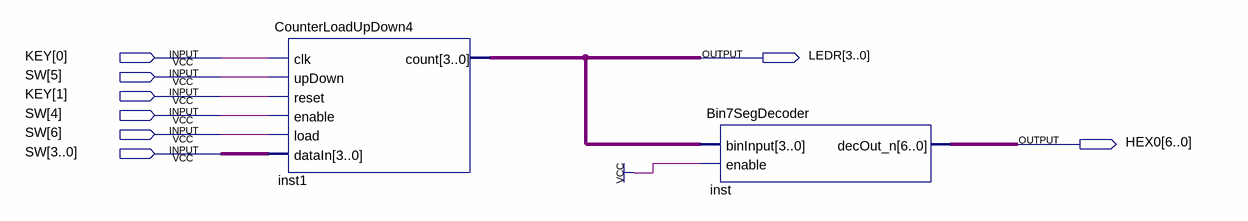
[diagram p0: schematic sheet]
// Quartus schematic Counter_Demo.bdf as structural Verilog: 2 symbols, 8 pins
module Counter_Demo (
  input  [1:0] KEY,
  input  [6:0] SW,
  output [3:0] LEDR,
  output [6:0] HEX0
);

  CounterLoadUpDown4 inst1 (
    .clk(KEY[0]), .upDown(SW[5]), .reset(KEY[1]), .enable(SW[4]), .load(SW[6]), .dataIn(SW[3:0]), .count(LEDR));
  Bin7SegDecoder inst (.binInput(LEDR), .enable(1'b1), .decOut_n(HEX0));
endmodule
